# Altium schematic sheet RADU-Master-S00-V00.SchDoc: RADU USB Connectivity (USB-C, ESD Protection, PH2.0)
size A3; DrawnBy: Jonn Dillon; DocumentNumber: 1; SheetNumber: 1; SheetTotal: 1; Version: 00; Project: QUTMS RADIO USB; PageSetup: Record=PageOptions|CenterHorizontal=True|CenterVertical=True|PrintScale=0.97|XCorrection=1.00|YCorrection=1.00|PrintKind=0|BorderSize=5000000|LeftOffset=0|BottomOffset=0|Orientation=2|PaperLength=1000|PaperWidth=1000|Scale=100|PaperSource=7|PrintQuality=-4|MediaType=1|DitherType=10|PaperKind=A4|PrintScaleMode=1
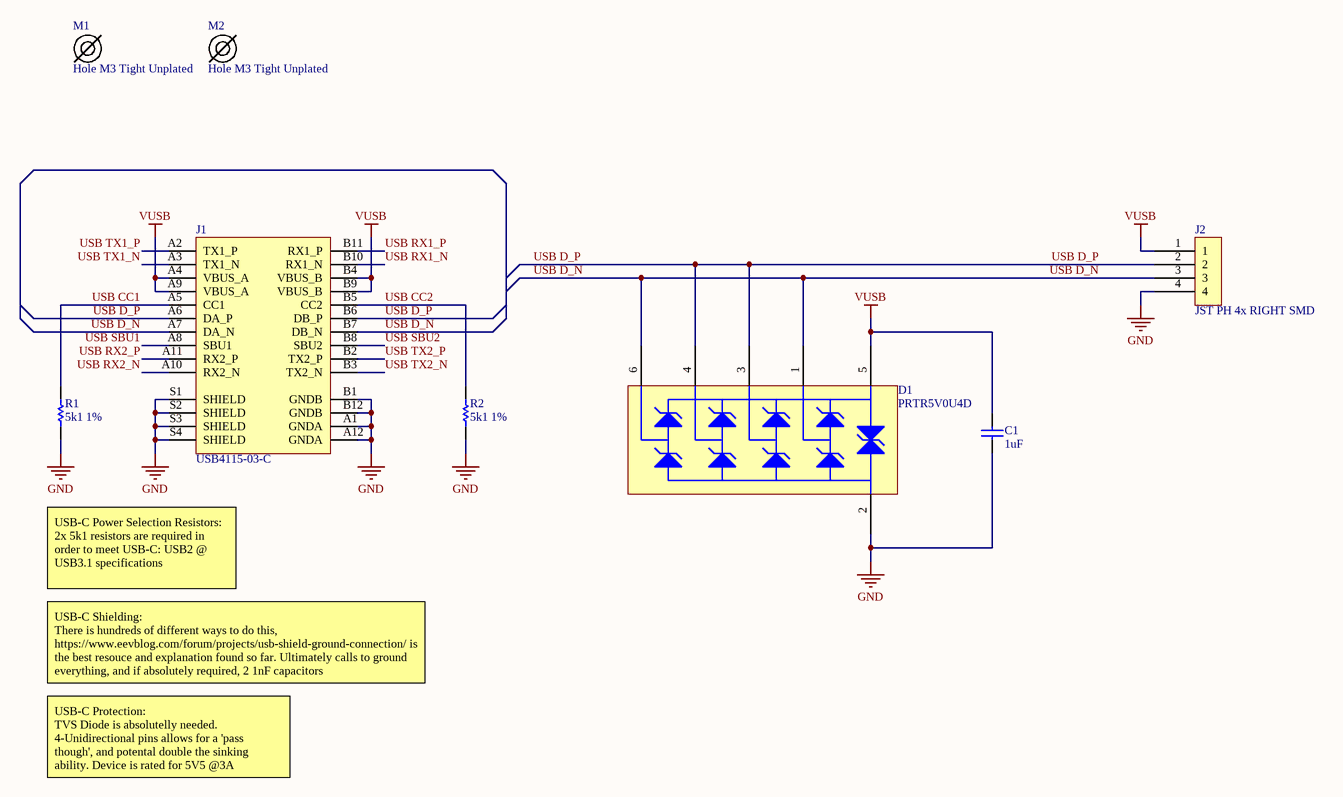
[diagram p0: RADU-Master-S00-V00.SchDoc]

## Parts
C1  1uF  [Cap_Ceramic_0603]
D1  PRTR5V0U4D  [SC-47]
J1  USB4115-03-C  [USB4115-03-C]
J2  JST PH 4x RIGHT SMD  [JST PH 4x RIGHT SMD]
M1  Hole M3 Tight Unplated  [M3.2 UNPLATED]  (no BOM)
M2  Hole M3 Tight Unplated  [M3.2 UNPLATED]  (no BOM)
R1  5k1 1%  [Res_ThinFilm_0603]
R2  5k1 1%  [Res_ThinFilm_0603]

## Nets
GND: C1.1 D1.2(GND) J1.A1(GNDA) J1.A12(GNDA) J1.B1(GNDB) J1.B12(GNDB) J1.S1(SHIELD) J1.S2(SHIELD) J1.S3(SHIELD) J1.S4(SHIELD) J2.4 R1.1 R2.1
VUSB: C1.2 D1.5(VCC) J1.A4(VBUS_A) J1.A9(VBUS_A) J1.B4(VBUS_B) J1.B9(VBUS_B) J2.1
USB CC1: J1.A5(CC1) R1.2
USB CC2: J1.B5(CC2) R2.2
USB D_N: D1.1(P1) D1.6(P4) J1.A7(DA_N) J1.B7(DB_N) J2.3
USB D_P: D1.3(P2) D1.4(P3) J1.A6(DA_P) J1.B6(DB_P) J2.2
USB RX1_N: J1.B10(RX1_N)
USB RX1_P: J1.B11(RX1_P)
USB RX2_N: J1.A10(RX2_N)
USB RX2_P: J1.A11(RX2_P)
USB SBU1: J1.A8(SBU1)
USB SBU2: J1.B8(SBU2)
USB TX1_N: J1.A3(TX1_N)
USB TX1_P: J1.A2(TX1_P)
USB TX2_N: J1.B3(TX2_N)
USB TX2_P: J1.B2(TX2_P)

## Notes on the sheet
- USB-C Power Selection Resistors:
  2x 5k1 resistors are required in order to meet USB-C: USB2 @ USB3.1 specifications
- USB-C Shielding:
  There is hundreds of different ways to do this, https://www.eevblog.com/forum/projects/usb-shield-ground-connection/ is the best resouce and explanation found so far. Ultimately calls to ground everything, and if absolutely required, 2 1nF capacitors
- USB-C Protection:
  TVS Diode is absolutelly needed. 4-Unidirectional pins allows for a 'pass though', and potental double the sinking ability. Device is rated for 5V5 @3A
- Revision History:
- Sheet Title:
- Rev
- Date
- Description
- Project:
- Size:
- Drawn By:
- A3
- Number:
- Revision:
- Sheet
- Version:
- of
- QUT Motorsport
- O-120, Gardens Point
- 2 George Street
- Brisbane, QLD 4000
- Australia
- Print Date:
- Print Time:
- File Name:

## Library data of the parts
C1 = 1uF 25V 5% X7R 0603: Capacitor, Ceramic, SMD, 1uF, 25V, 5%, X7R, 0603
D1 = PRTR5V0U4D: Clamp Ipp Tvs Diode Surface Mount 6-TSOP
J1 = USB4115-03-C: USB-C (USB TYPE-C) USB 3.2 Gen 2 (USB 3.1 Gen 2, Superspeed + (USB 3.1)) Receptacle Connector 24 Position Surface Mount, Through Hole
M1 M2 = Hole M3 Tight Unplated: M3.2 Hole, No Plating
R1 R2 = 5k1 1% 0603: Resistor, SMD, 5k1, 0.1W, 1%, 0603